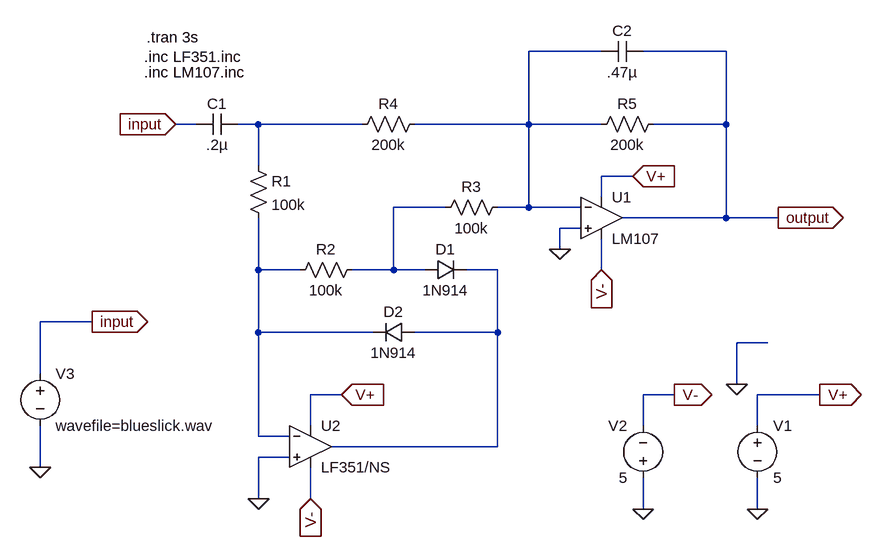
[diagram p0: schematic aad.asc]
aad.asc, the LTspice schematic file:
Version 4
SHEET 1 940 680
WIRE 496 -192 384 -192
WIRE 688 -192 560 -192
WIRE -128 -80 -160 -80
WIRE -32 -80 -64 -80
WIRE 128 -80 -32 -80
WIRE 384 -80 384 -192
WIRE 384 -80 208 -80
WIRE 496 -80 384 -80
WIRE 688 -80 688 -192
WIRE 688 -80 576 -80
WIRE -32 -16 -32 -80
WIRE 544 0 496 0
WIRE 496 32 496 0
WIRE 256 48 176 48
WIRE 384 48 384 -80
WIRE 384 48 336 48
WIRE 464 48 384 48
WIRE 688 64 688 -80
WIRE 688 64 528 64
WIRE 768 64 688 64
WIRE 464 80 432 80
WIRE 432 112 432 80
WIRE -32 144 -32 64
WIRE 32 144 -32 144
WIRE 176 144 176 48
WIRE 176 144 112 144
WIRE 224 144 176 144
WIRE 336 144 288 144
WIRE 496 144 496 96
WIRE -288 224 -368 224
WIRE -32 240 -32 144
WIRE 144 240 -32 240
WIRE 336 240 336 144
WIRE 336 240 208 240
WIRE 752 256 704 256
WIRE -368 304 -368 224
WIRE 704 320 704 256
WIRE 96 336 48 336
WIRE 608 336 560 336
WIRE 832 336 736 336
WIRE 48 384 48 336
WIRE 560 384 560 336
WIRE 736 384 736 336
WIRE -32 400 -32 240
WIRE 16 400 -32 400
WIRE 336 416 336 240
WIRE 336 416 80 416
WIRE 16 432 -32 432
WIRE -368 448 -368 384
WIRE -32 496 -32 432
WIRE 48 496 48 448
WIRE 560 512 560 464
WIRE 736 512 736 464
FLAG -160 -80 input
IOPIN -160 -80 In
FLAG 432 112 0
FLAG -32 496 0
FLAG 768 64 output
IOPIN 768 64 Out
FLAG 736 512 0
FLAG 832 336 V+
IOPIN 832 336 Out
FLAG 96 336 V+
IOPIN 96 336 In
FLAG 48 496 V-
IOPIN 48 496 In
FLAG 560 512 0
FLAG 544 0 V+
IOPIN 544 0 In
FLAG 496 144 V-
IOPIN 496 144 In
FLAG -368 448 0
FLAG -288 224 input
IOPIN -288 224 Out
FLAG 704 320 0
FLAG 608 336 V-
IOPIN 608 336 Out
SYMBOL res -48 -32 R0
SYMATTR InstName R1
SYMATTR Value 100k
SYMBOL res 112 -64 R270
WINDOW 0 32 56 VTop 2
WINDOW 3 0 56 VBottom 2
SYMATTR InstName R4
SYMATTR Value 200k
SYMBOL res 128 128 R90
WINDOW 0 0 56 VBottom 2
WINDOW 3 32 56 VTop 2
SYMATTR InstName R2
SYMATTR Value 100k
SYMBOL res 352 32 R90
WINDOW 0 0 56 VBottom 2
WINDOW 3 32 56 VTop 2
SYMATTR InstName R3
SYMATTR Value 100k
SYMBOL diode 224 160 R270
WINDOW 0 32 32 VTop 2
WINDOW 3 0 32 VBottom 2
SYMATTR InstName D1
SYMATTR Value 1N914
SYMBOL Opamps\\opamp2 496 0 R0
SYMATTR InstName U1
SYMATTR Value LM107
SYMBOL diode 208 224 R90
WINDOW 0 0 32 VBottom 2
WINDOW 3 32 32 VTop 2
SYMATTR InstName D2
SYMATTR Value 1N914
SYMBOL Opamps\\opamp2 48 352 R0
SYMATTR InstName U2
SYMATTR Value LF351/NS
SYMBOL res 592 -96 R90
WINDOW 0 0 56 VBottom 2
WINDOW 3 32 56 VTop 2
SYMATTR InstName R5
SYMATTR Value 200k
SYMBOL cap 560 -208 R90
WINDOW 0 0 32 VBottom 2
WINDOW 3 32 32 VTop 2
SYMATTR InstName C2
SYMATTR Value .47µ
SYMBOL cap -64 -96 R90
WINDOW 0 0 32 VBottom 2
WINDOW 3 32 32 VTop 2
SYMATTR InstName C1
SYMATTR Value .2µ
SYMBOL voltage 736 368 R0
WINDOW 123 0 0 Left 2
WINDOW 39 0 0 Left 2
SYMATTR InstName V1
SYMATTR Value 5
SYMBOL voltage 560 480 R180
WINDOW 0 24 96 Left 2
WINDOW 3 24 16 Left 2
WINDOW 123 0 0 Left 2
WINDOW 39 0 0 Left 2
SYMATTR InstName V2
SYMATTR Value 5
SYMBOL voltage -368 288 R0
SYMATTR InstName V3
SYMATTR Value wavefile=blueslick.wav
TEXT -208 -184 Left 2 !.inc LF351.inc
TEXT -204 -214 Left 2 !.tran 3s
TEXT -208 -160 Left 2 !.inc LM107.inc

The netlist it stands for:
* aad.asc
R1 N002 N004 100k
R4 N002 N001 200k
R2 N003 N004 100k
R3 N001 N003 100k
D1 N003 N005 1N914
XU1 0 N001 V+ V- output LM107  ; pins In+ In- V+ V- OUT
D2 N005 N004 1N914
XU2 0 N004 V+ V- N005 LF351/NS  ; pins In+ In- V+ V- OUT
R5 output N001 200k
C2 output N001 .47µ
C1 N002 input .2µ
V1 V+ 0 5
V2 0 V- 5
V3 input 0 wavefile=blueslick.wav
.model D D
.lib standard.dio
.inc LF351.inc
.tran 3s
.inc LM107.inc
.backanno
.end